# Altium schematic sheet DIGITAL_IO.SchDoc: Digital IO
size B; Engineer: M. Jones; Organization: Michael Jones; DocumentNumber: 6; Revision: RA.1; SheetNumber: 6; SheetTotal: 7
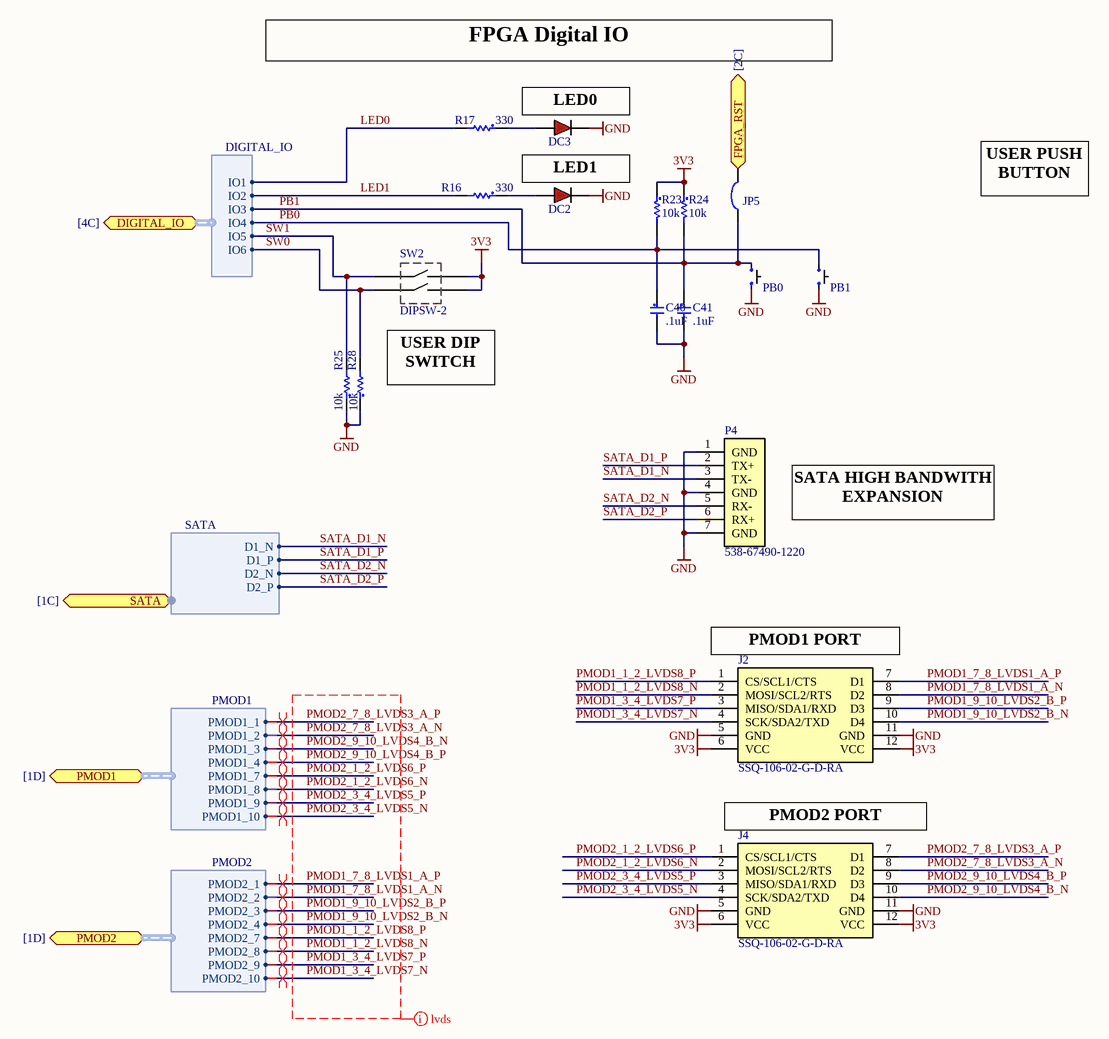
[diagram p0: DIGITAL_IO.SchDoc]

## Parts
C40  .1uF  [c0603]
C41  .1uF  [c0603]
DC2  598-8010-107F  [LED_0603 - RED]  (value not drawn)
DC3  598-8010-107F  [LED_0603 - RED]  (value not drawn)
J2  SSQ-106-02-G-D-RA  [PMOD HEADER - SSQ-106-02-G-D-RA]
J4  SSQ-106-02-G-D-RA  [PMOD HEADER - SSQ-106-02-G-D-RA]
JP5  Solder Jumper  [SOLDER_JUMPER]  (value not drawn)  (no BOM)
P4  Supplier Part Number 1: 538-67490-1220  [SATA - 67490-3220]  (hidden comment: SATA - 67490-1220)
PB0  (no value)  [FSM4JSMA]
PB1  (no value)  [FSM4JSMA]
R16  330  [R0603]
R17  330  [R0603]
R23  10k  [R0603]
R24  10k  [R0603]
R25  10k  [R0603]
R28  10k  [R0603]
SW2  DIPSW-2  [DIPSW - 219-2MST]

## Ports
DIGITAL_IO (harness DIGITAL_IO, see [4C]), FPGA_RST (see [2C]), PMOD1 (harness PMOD1, see [1D]), PMOD2 (harness PMOD2, see [1D]), SATA (harness SATA, see [1C])

## Harnesses
DIGITAL_IO: IO1, IO2, IO3, IO4, IO5, IO6
SATA: D1_P, D1_N, D2_N, D2_P
PMOD1: PMOD1_1, PMOD1_2, PMOD1_3, PMOD1_4, PMOD1_7, PMOD1_8, PMOD1_9, PMOD1_10
PMOD2: PMOD2_1, PMOD2_2, PMOD2_3, PMOD2_4, PMOD2_7, PMOD2_8, PMOD2_9, PMOD2_10

## Nets
3V3: J2.6(VCC) J2.12(VCC) J4.6(VCC) J4.12(VCC) R23.1 R24.1 SW2.B1 SW2.B2
GND: C40.2 C41.2 DC2.C DC3.C J2.5(GND) J2.11(GND) J4.5(GND) J4.11(GND) P4.1(GND) P4.4(GND) P4.7(GND) PB0.A PB1.A R25.1 R28.1
FPGA_RST: JP5.2 ; port FPGA_RST
LED0: R17.2 ; port DIGITAL_IO.IO1
LED1: R16.2 ; port DIGITAL_IO.IO2
PB0: C40.1 PB1.B R23.2 ; port DIGITAL_IO.IO4
PB1: C41.1 JP5.1 PB0.B R24.2 ; port DIGITAL_IO.IO3
PMOD1_1_2_LVDS8_N: J2.2(MOSI/SCL2/RTS) ; port PMOD2.PMOD2_8
PMOD1_1_2_LVDS8_P: J2.1(CS/SCL1/CTS) ; port PMOD2.PMOD2_7
PMOD1_3_4_LVDS7_N: J2.4(SCK/SDA2/TXD) ; port PMOD2.PMOD2_10
PMOD1_3_4_LVDS7_P: J2.3(MISO/SDA1/RXD) ; port PMOD2.PMOD2_9
PMOD1_7_8_LVDS1_A_N: J2.8(D2) ; port PMOD2.PMOD2_2
PMOD1_7_8_LVDS1_A_P: J2.7(D1) ; port PMOD2.PMOD2_1
PMOD1_9_10_LVDS2_B_N: J2.10(D4) ; port PMOD2.PMOD2_4
PMOD1_9_10_LVDS2_B_P: J2.9(D3) ; port PMOD2.PMOD2_3
PMOD2_1_2_LVDS6_N: J4.2(MOSI/SCL2/RTS) ; port PMOD1.PMOD1_8
PMOD2_1_2_LVDS6_P: J4.1(CS/SCL1/CTS) ; port PMOD1.PMOD1_7
PMOD2_3_4_LVDS5_N: J4.4(SCK/SDA2/TXD) ; port PMOD1.PMOD1_10
PMOD2_3_4_LVDS5_P: J4.3(MISO/SDA1/RXD) ; port PMOD1.PMOD1_9
PMOD2_7_8_LVDS3_A_N: J4.8(D2) ; port PMOD1.PMOD1_2
PMOD2_7_8_LVDS3_A_P: J4.7(D1) ; port PMOD1.PMOD1_1
PMOD2_9_10_LVDS4_B_N: J4.10(D4) ; port PMOD1.PMOD1_3
PMOD2_9_10_LVDS4_B_P: J4.9(D3) ; port PMOD1.PMOD1_4
SATA_D1_N: P4.3(TX-) ; port SATA.D1_N
SATA_D1_P: P4.2(TX+) ; port SATA.D1_P
SATA_D2_N: P4.5(RX-) ; port SATA.D2_N
SATA_D2_P: P4.6(RX+) ; port SATA.D2_P
SW0: R28.2 SW2.A2 ; port DIGITAL_IO.IO6
SW1: R25.2 SW2.A1 ; port DIGITAL_IO.IO5
NetDC2_A: DC2.A R16.1
NetDC3_A: DC3.A R17.1

## Layout directives
differential pair: PMOD1_1_2_LVDS8_N, PMOD1_1_2_LVDS8_P, PMOD1_3_4_LVDS7_N, PMOD1_3_4_LVDS7_P, PMOD1_7_8_LVDS1_A_N, PMOD1_7_8_LVDS1_A_P, PMOD1_9_10_LVDS2_B_N, PMOD1_9_10_LVDS2_B_P, PMOD2_1_2_LVDS6_N, PMOD2_1_2_LVDS6_P, PMOD2_3_4_LVDS5_N, PMOD2_3_4_LVDS5_P, PMOD2_7_8_LVDS3_A_N, PMOD2_7_8_LVDS3_A_P, PMOD2_9_10_LVDS4_B_N, PMOD2_9_10_LVDS4_B_P
net class lvds: PMOD1_1_2_LVDS8_N, PMOD1_1_2_LVDS8_P, PMOD1_3_4_LVDS7_N, PMOD1_3_4_LVDS7_P, PMOD1_7_8_LVDS1_A_N, PMOD1_7_8_LVDS1_A_P, PMOD1_9_10_LVDS2_B_N, PMOD1_9_10_LVDS2_B_P, PMOD2_1_2_LVDS6_N, PMOD2_1_2_LVDS6_P, PMOD2_3_4_LVDS5_N, PMOD2_3_4_LVDS5_P, PMOD2_7_8_LVDS3_A_N, PMOD2_7_8_LVDS3_A_P, PMOD2_9_10_LVDS4_B_N, PMOD2_9_10_LVDS4_B_P

## Notes on the sheet
- FPGA Digital IO
- (near DC3) LED0
- (near DC2) LED1
- USER PUSH BUTTON
- USER DIP SWITCH
- SATA HIGH BANDWITH EXPANSION
- (near J2) PMOD1 PORT
- (near J4) PMOD2 PORT
- Title
- Revision:
- Sheet
- of
- Date:
- Engineer:

## Library data of the parts
C40 C41 = C0603 - CL10F104ZA8NNNC: CAP CER 0.1UF 25V Y5V 0603; Manufacturer: Samsung Electro-Mechanics America, Inc; Capacitance: 0.1µF; Tolerance: -20%, +80%; Temperature Coefficient: Y5V (F); Accept Alternative: Yes; Value: .1uF; Supplier 1: Digi-Key; Supplier Part Number 1: 1276-1011-1-ND; Manufacturer Part Number: CL10F104ZA8NNNC; RoHS: RoHS Compliant; Category: Capacitors; Stock 1: 400907; Pricing 1: 1=0.1, 10=0.017, 25=0.012, 50=0.009, 100=0.0076, 250=0.00624, 500=0.00536, 1000=0.00417 (USD); Package / Case: 0603 (1608 Metric); Packaging: Cut Tape (CT); ComponentLink1URL: http://www.samsungsem.com/servlet/FileDownload?type=spec&file=CL10F104ZA8NNNC.pdf; ComponentLink1Description: http://www.samsungsem.com/servlet/FileDownload?type=spec&file=CL10F104ZA8NNNC.pdf; Voltage - Rated: 25V; Mounting Type: Surface Mount, MLCC; Operating Temperature: -30°C ~ 85°C; Applications: General Purpose; Ratings: -; Size / Dimension: 0.063" L x 0.031" W (1.60mm x 0.80mm); Height - Seated (Max): -; Thickness (Max): 0.035" (0.90mm); Lead Spacing: -; Features: -; Lead Style: -; Accept Compatible Replacement Part: Yes
DC2 DC3 = LED0603 - 598-8010-107F: LED ALINGAP RED CLEAR 0603 SMD; Manufacturer: Dialight; Current - Test: 20mA; Wavelength - Dominant: 635nm; Millicandela Rating: 40mcd; Voltage - Forward (Vf) Typ: 2.2V; Lens Style/Size: Rectangle with Flat Top, 1.1mm x 0.8mm; Viewing Angle: 140°; Accept Replacement: YES - Water Clear; Supplier 1: Digi-Key; Manufacturer Part Number: 598-8010-107F; RoHS: RoHS Compliant; Category: Optoelectronics; Stock 1: 37578; Pricing 1: 1=0.45, 10=0.33, 25=0.264, 100=0.1749, 250=0.1452, 500=0.1056, 1000=0.0825 (USD); Color: Red; Luminous Flux @ Current - Test: -; Wavelength - Peak: -; Lens Type: Clear; Size / Dimension: 1.60mm L x 0.80mm W; Height: 0.70mm; Package / Case: 0603 (1608 Metric); Mounting Type: Surface Mount; Packaging: Digi-Reel®; ComponentLink1URL: http://media.digikey.com/pdf/Data%20Sheets/Dialight%20PDFs/598_Series_0603_Pkg.pdf; ComponentLink1Description: http://media.digikey.com/pdf/Data%20Sheets/Dialight%20PDFs/598_Series_0603_Pkg.pdf; Supplier Part Number 1: 350-2029-6-ND
J2 J4 = P-MOD - SSQ-106-02-G-D-RA: SAMTEC - SSQ-106-02-G-D-RA-005 - 2MM SOCKET STRIPS; Supplier 1: Samtec; Supplier Part Number 1: SSQ-106-02-G-D-RA; Manufacturer: SAMTEC; Manufacturer Part Number: SSQ-106-02-G-D-RA; Stock 1: 0; Pricing 1: 1=1.58, 100=1.58, 1000=1.58 (USD); Value: SSQ-106-02-G-D-RA
JP5 = Solder Jumper: Solder/Configuration Jumper; Manufacturer: n/a; Manufacturer Part Number: n/a; Source: n/a; Source Part Number: n/a; ROHS Certificate: n/a
P4 = SATA - 67490-1220: SATA Data - 67490-1220; Manufacturer: Molex; 1Notes: looks more standard need, different footprint; Gender: Male; Pitch: 1.27 mm; Number of Positions / Contacts: 7; Supplier 1: Mouser; Manufacturer Part Number: 67490-1220; RoHS: RoHS Compliant; Category: I/O Connectors; Stock 1: 475; Pricing 1: 1=1.28, 10=1.07, 100=0.792, 500=0.640, 1000=0.572, 2000=0.525 (AUD); Packaging: Tray; Product: SATA Connectors; Termination Style: Solder Terminal; Mounting Style: SMD/SMT; Product Category: 1.27mm Connectors; Standard Pack Qty: 2880; RoHS - Mouser: Y; Minimum Order Quantity: 1; Reeling: False; ComponentLink1URL: http://www.molex.com/webdocs/datasheets/pdf/en-us/0674901220_PCB_HEADERS.pdf; ComponentLink1Description: http://www.molex.com/webdocs/datasheets/pdf/en-us/0674901220_PCB_HEADERS.pdf
PB0 PB1 = FSM4JSMATR: SWITCH TACTILE SPST-NO 0.05A 12V; Manufacturer: TE Connectivity; Switch Function: Off-Mom; Contact Rating @ Voltage: 0.05A @ 12VDC; Actuator Type: Standard; Outline: 6.00mm x 6.00mm; Illumination: Non-Illuminated; Operating Force: 160gf; Actuator Height off PCB, from Pins: 5.00mm; Actuator Orientation: Top Actuated; Actuator Material: Polyphenylene Sulfide (PPS); Switch Travel: 0.25mm; Mechanical Life: 100,000 Cycles; Supplier 1: Digi-Key; Supplier Part Number 1: 450-1129-ND; Manufacturer Part Number: FSM4JSMA; RoHS: RoHS Compliant; Category: Switches; Stock 1: 13038; Pricing 1: 1=0.26, 10=0.246, 25=0.2096, 50=0.1834, 100=0.1703, 250=0.15064, 500=0.1441, 1000=0.1179, 5000=0.09825 (USD); Circuit: SPST-NO; Mounting Type: Surface Mount; Termination Style: Gull Wing; Packaging: Bulk; ComponentLink1URL: http://www.te.com/commerce/DocumentDelivery/DDEController?Action=srchrtrv&DocNm=2-1437565-7&DocType=Customer+Drawing&DocLang=English; ComponentLink1Description: http://www.te.com/commerce/DocumentDelivery/DDEController?Action=srchrtrv&DocNm=2-1437565-7&DocType=Customer+Drawing&DocLang=English; Illumination Voltage (Nominal): -; Illumination Type, Color: -; Ingress Protection: -; Features: -; Operating Temperature: -35°C ~ 85°C
R16 R17 = R0603 - ERJ-3GEYJ331V: Thick Film Resistors - SMD 0603 330ohms 5% Tol; Manufacturer: Panasonic; Temperature Coefficient: 200 PPM / C; Power Rating: 100 mW; Voltage Rating: 75 V; Manufacturer Part Number: ERJ-3GEYJ331V; Value: 330; Supplier 1: Mouser; Supplier Part Number 1: 667-ERJ-3GEYJ331V; RoHS: RoHS Compliant By Exemption; Category: Thick Film Resistors - SMD; Stock 1: 131470; Pricing 1: 1=0.108, 10=0.012, 100=0.005, 1000=0.004, 5000=0.003 (AUD); Tolerance: 5 %; Packaging: Reel; Package / Case: 0603 (1608 metric); ComponentLink1URL: http://www.mouser.com/ds/2/315/AOA0000CE1-37422.pdf; ComponentLink1Description: http://www.mouser.com/ds/2/315/AOA0000CE1-37422.pdf; Dimensions: 0.8 mm W x 1.6 mm L x 0.45 mm H; Operating Temperature Range: - 55 C to + 155 C; Product: Thick Film Resistors SMD; Resistance: 330 Ohms; Series: ERJ; Termination Style: SMD/SMT; Case Code - in: 0603; Case Code - mm: 1608; Standard Pack Qty: 5000; RoHS - Mouser: E; Minimum Order Quantity: 1; Reeling: True
R23-R25 R28 = R0603 - CRCW060310K0FKEA: 10k Thick Film Resistors - SMD 1/10watt 10Kohms 1%; Manufacturer: Vishay Dale; Power (Watts): 0.1W, 1/10W; Temperature Coefficient: ±100ppm/°C; Supplier 1: Digi-Key; Manufacturer Part Number: CRCW060310K0FKEA; RoHS: RoHS Compliant; Category: Resistors; Stock 1: 997856; Pricing 1: 10=0.081, 50=0.0436, 200=0.0251, 1000=0.01711 (USD); Resistance (Ohms): 10K; Composition: Thick Film; Features: -; Tolerance: ±1%; Package / Case: 0603 (1608 Metric); Size / Dimension: 0.061" L x 0.033" W (1.55mm x 0.85mm); Height: 0.020" (0.50mm); Number of Terminations: 2; Packaging: Cut Tape (CT); ComponentLink1URL: http://www.vishay.com/doc?20035; ComponentLink1Description: http://www.vishay.com/doc?20035; Supplier Part Number 1: 541-10.0KHCT-ND; Value: 10k
SW2 = DIPSW - 219-2MST: DIP Switches / SIP Switches SPST 2 switch sections; Manufacturer: CTS Electronic Components; Number of Positions: 2; Supplier 1: Mouser; Manufacturer Part Number: 219-2MST; RoHS: RoHS Compliant; Category: DIP Switches / SIP Switches; Stock 1: 3237; Pricing 1: 1=0.580, 10=0.530, 100=0.480, 500=0.350, 1000=0.300, 5000=0.270 (USD); Operating Temperature Range: - 55 C to + 85 C; Packaging: Tube; Terminal Pitch: 2.54 mm; Termination Style: SMD/SMT; Switch Type: DIP; Product Category: DIP Switches; RoHS - Mouser: Y; Minimum Order Quantity: 1; Reeling: False; ComponentLink1URL: http://www.ctscorp.com/components/Datasheets/219.pdf; ComponentLink1Description: http://www.ctscorp.com/components/Datasheets/219.pdf; Supplier Part Number 1: 774-2192MST